# EAGLE design BottomPCB (EAGLE 6.3)
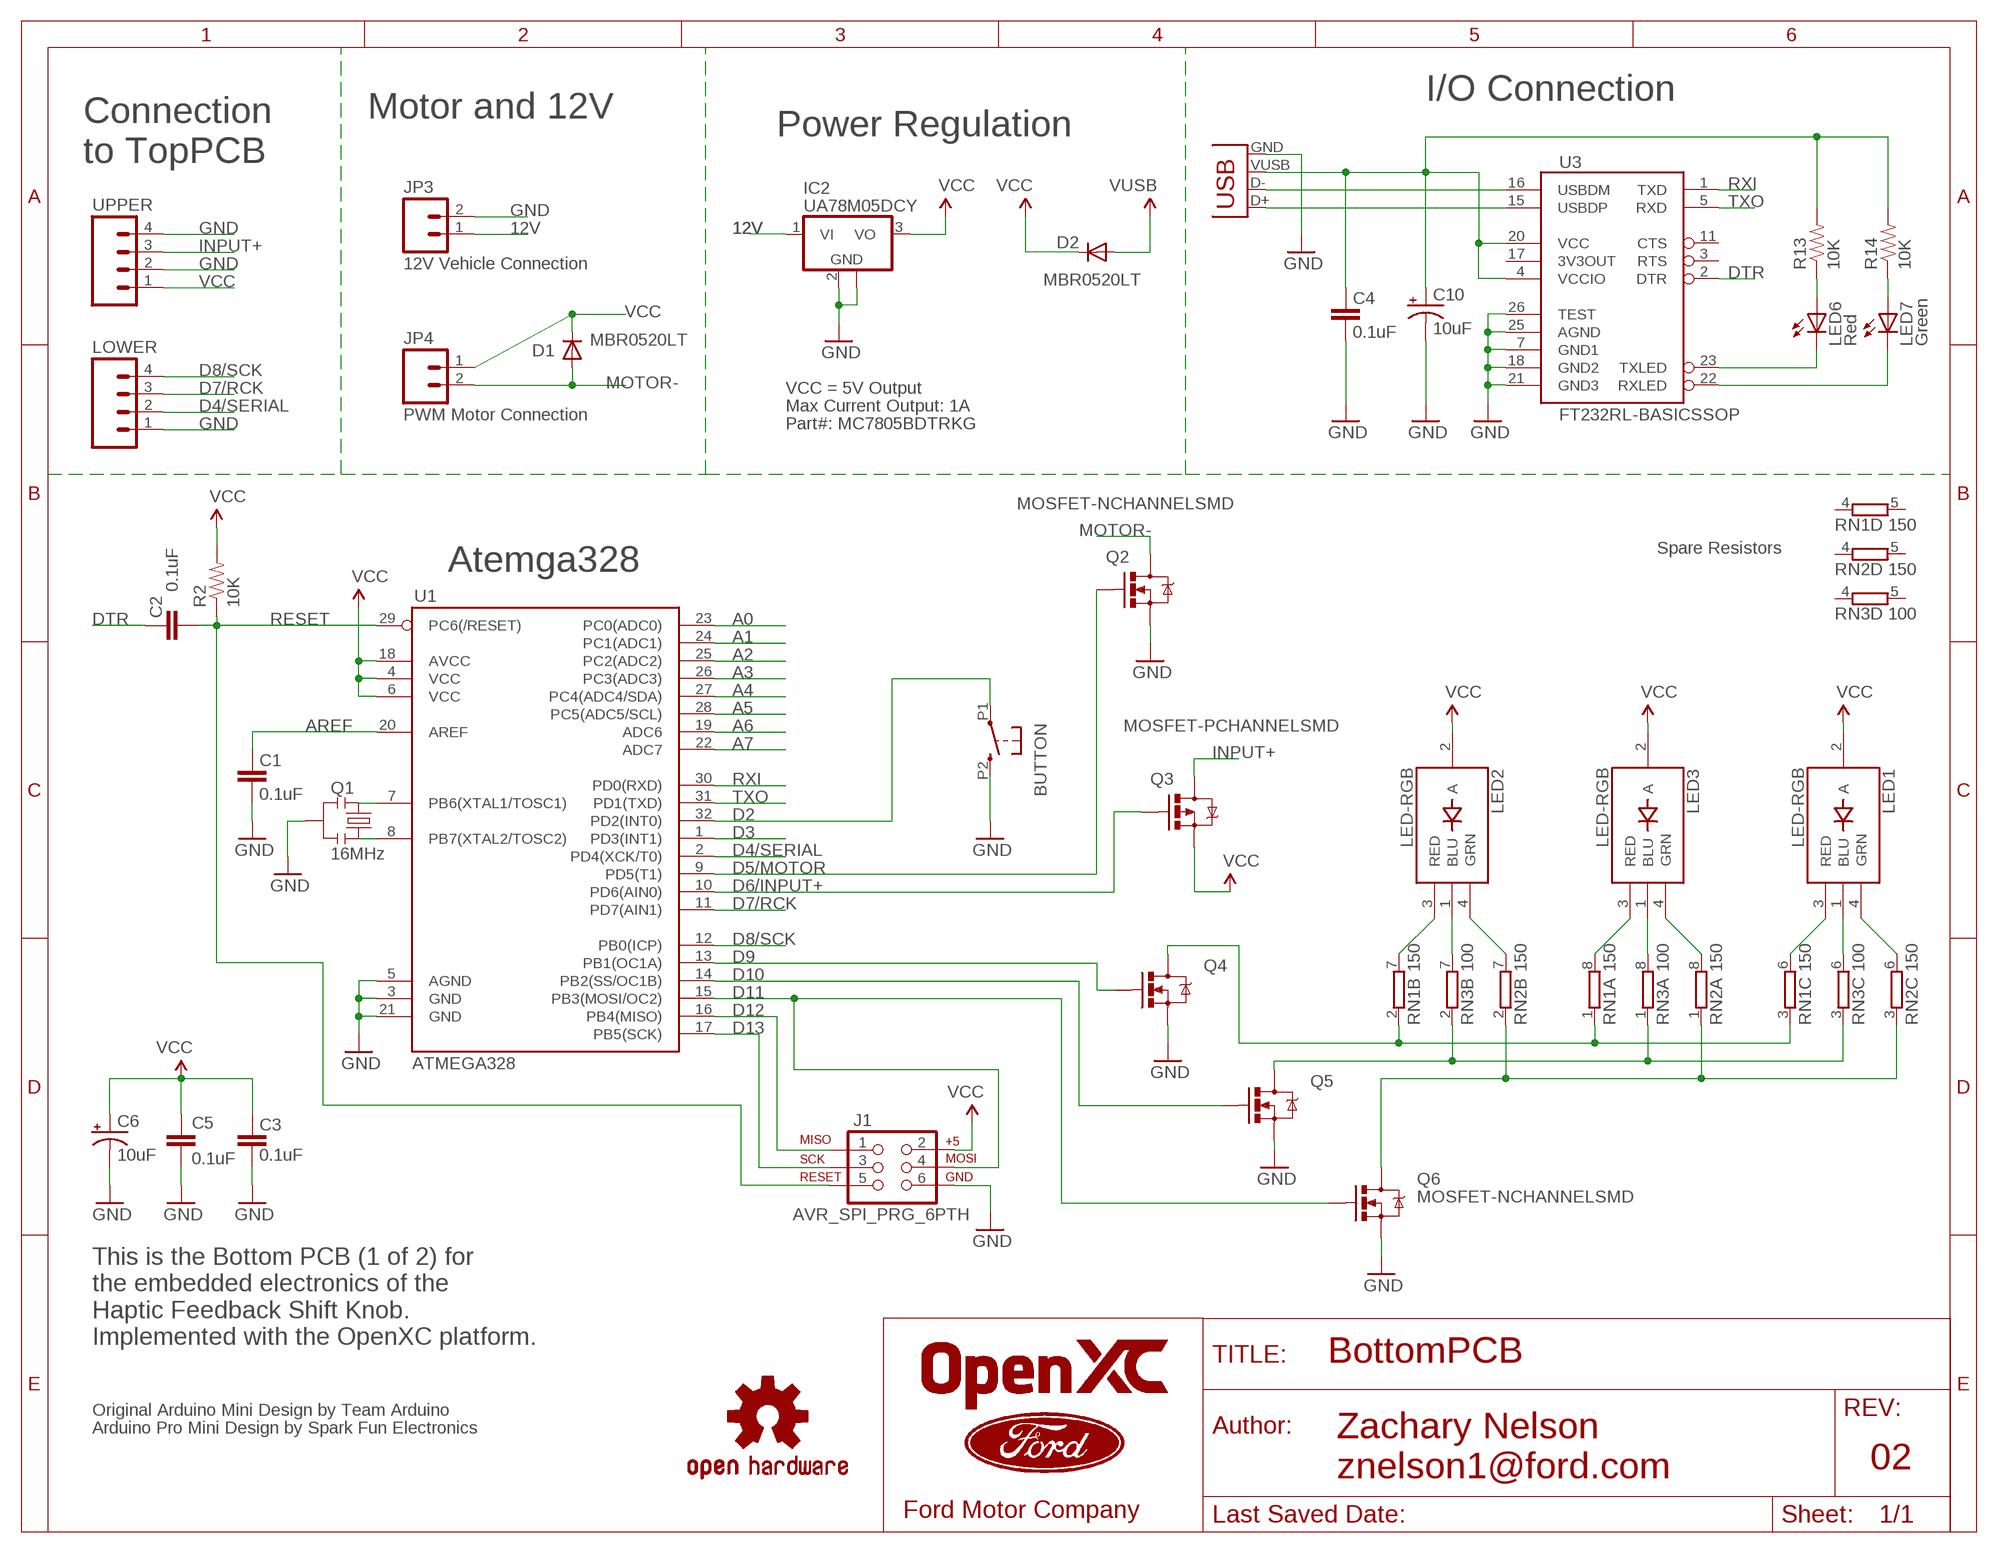
[diagram p0: schematic, sheet 1]

## Parts
BUTTON  BUTTON_EDGE  [BUTTON_EDGE]
C1  0.1uF  CAP0402-CAP  [0402-CAP]
C2  0.1uF  CAP0402-CAP  [0402-CAP]
C3  0.1uF  CAP0402-CAP  [0402-CAP]
C4  0.1uF  CAP0402-CAP  [0402-CAP]
C5  0.1uF  CAP0402-CAP  [0402-CAP]
C6  10uF  CAP_POL1206  [EIA3216]
C10  10uF  CAP_POL1206  [EIA3216]
D1  MBR0520LT  [SOD123]
D2  MBR0520LT  [SOD123]
IC2  UA78M05DCY  [SOT223]
J1  AVR_SPI_PRG_6PTH  [2X3]
JP3  12V Vehicle Connection  M02PTH  [1X02]
JP4  PWM Motor Connection  M02-JST-2MM-SMT  [JST-2-SMD]
LED1  LED-RGB  [LED-RGB_SMD-RIGHTANGLE]
LED2  LED-RGB  [LED-RGB_SMD-RIGHTANGLE]
LED3  LED-RGB  [LED-RGB_SMD-RIGHTANGLE]
LED6  Red  LED0603  [LED-0603]
LED7  Green  LED0603  [LED-0603]
LOWER  M04PTH  [1X04]
Q1  16MHz  RESONATORSMD  [RESONATOR-SMD]
Q2  MOSFET-NCHANNELSMD  [SOT23-3]
Q3  MOSFET-PCHANNELSMD  [SOT23-3]
Q4  MOSFET-NCHANNELSMD  [SOT23-3]
Q5  MOSFET-NCHANNELSMD  [SOT23-3]
Q6  MOSFET-NCHANNELSMD  [SOT23-3]
R2  10K  RESISTOR0402-RES  [0402-RES]
R13  10K  RESISTOR0402-RES  [0402-RES]
R14  10K  RESISTOR0402-RES  [0402-RES]
RN1  150  4R-NEXBS8V  [EXBS8V]
RN2  150  4R-NEXBS8V  [EXBS8V]
RN3  100  4R-NEXBS8V  [EXBS8V]
U1  ATMEGA328  ATMEGA168  [TQFP32-08]
U3  FT232RL-BASICSSOP  [SSOP28DB]
U6  USB-MINI-B_VERTICAL  [USB-MINI-B_VERTICAL]
U$3  OSHW-LOGOS  [OSHW-LOGO-S]
UPPER  M04PTH  [1X04]

## Nets
12V [vcc]: IC2.1(VI) JP3.1
A0: U1.23(PC0(ADC0))
A1: U1.24(PC1(ADC1))
A2: U1.25(PC2(ADC2))
A3: U1.26(PC3(ADC3))
A4: U1.27(PC4(ADC4/SDA))
A5: U1.28(PC5(ADC5/SCL))
A6: U1.19(ADC6)
A7: U1.22(ADC7)
AREF: C1.2 U1.20(AREF)
D2: BUTTON.P1 U1.32(PD2(INT0))
D3: U1.1(PD3(INT1))
D4/SERIAL: LOWER.2 U1.2(PD4(XCK/T0))
D5/MOTOR: Q2.1(G) U1.9(PD5(T1))
D6/INPUT+: Q3.1(G) U1.10(PD6(AIN0))
D7/RCK: LOWER.3 U1.11(PD7(AIN1))
D8/SCK: LOWER.4 U1.12(PB0(ICP))
D9: Q4.3(D) RN1.1 RN1.2 RN1.3
D10: Q5.3(D) RN3.1 RN3.2 RN3.3
D11: Q6.3(D) RN2.1 RN2.2 RN2.3
D12: J1.1 U1.16(PB4(MISO))
D13: J1.3 U1.17(PB5(SCK))
DTR: C2.2 U3.2(DTR)
GND: BUTTON.P2 C1.1 C3.1 C4.1 C5.2 C6.C(-) C10.C(-) IC2.2(GND) IC2.4(GND) J1.6 JP3.2 LOWER.1 Q1.2 Q2.2(S) Q4.2(S) Q5.2(S) Q6.2(S) U1.3(GND) U1.5(AGND) U1.21(GND) U3.7(GND1) U3.18(GND2) U3.21(GND3) U3.25(AGND) U3.26(TEST) U6.GND UPPER.2 UPPER.4
INPUT+: Q3.3(D) UPPER.3
MOTOR-: D1.A JP4.2 Q2.3(D)
N$1: Q1.1 U1.8(PB7(XTAL2/TOSC2))
N$2: Q1.3 U1.7(PB6(XTAL1/TOSC1))
N$4: LED2.3(RED) RN1.7
N$5: LED2.4(GRN) RN2.7
N$6: LED3.3(RED) RN1.8
N$7: LED1.1(BLU) RN3.6
N$8: LED3.4(GRN) RN2.8
N$9: LED1.3(RED) RN1.6
N$10: LED1.4(GRN) RN2.6
N$11: Q4.1(G) U1.13(PB1(OC1A))
N$12: Q5.1(G) U1.14(PB2(SS/OC1B))
N$15: J1.4 Q6.1(G) U1.15(PB3(MOSI/OC2))
N$16: LED2.1(BLU) RN3.7
N$20: LED3.1(BLU) RN3.8
N$21: U3.15(USBDP) U6.D+
N$22: U3.16(USBDM) U6.D-
N$23: LED6.A R13.1
N$24: LED7.A R14.1
RESET: C2.1 J1.5 R2.1 U1.29(PC6(/RESET))
RXI: U1.30(PD0(RXD)) U3.1(TXD)
RXLED1: LED7.C U3.22(RXLED)
TXLED1: LED6.C U3.23(TXLED)
TXO: U1.31(PD1(TXD)) U3.5(RXD)
VCC [vcc]: C3.2 C5.1 C6.A(+) D1.C D2.C IC2.3(VO) J1.2 JP4.1 LED1.2(A) LED2.2(A) LED3.2(A) Q3.2(S) R2.2 U1.4(VCC) U1.6(VCC) U1.18(AVCC) UPPER.1
VUSB: C4.2 C10.A(+) D2.A R13.2 R14.2 U3.4(VCCIO) U3.20(VCC) U6.VUSB(VBUS)
Unconnected: RN1.4 RN1.5 RN2.4 RN2.5 RN3.4 RN3.5 U3.3(RTS) U3.11(CTS) U3.17(3V3OUT)

## Notes on the sheet
- I/O Connection
- Motor and 12V
- Power Regulation
- Connection
  to TopPCB
- VCC = 5V Output
- Max Current Output: 1A
- Part#: MC7805BDTRKG
- Spare Resistors
- Atemga328
- This is the Bottom PCB (1 of 2) for 
  the embedded electronics of the 
  Haptic Feedback Shift Knob. 
  Implemented with the OpenXC platform.
- Original Arduino Mini Design by Team Arduino
- Arduino Pro Mini Design by Spark Fun Electronics
- 02
- Zachary Nelson
  znelson1@ford.com

## Library data of the parts
BUTTON = FORD_frames:BUTTON_EDGE
C1-C5 = SparkFun:CAP: Capacitor Standard 0603 ceramic capacitor, and 0.1" leaded capacitor.
C6 C10 = SparkFun:CAP_POL: Capacitor Polarized These are standard SMD and PTH capacitors. Normally 10uF, 47uF, and 100uF in electrolytic and tantalum varieties. Always verify the external diameter of the through hole cap, it varies with capacity, voltage, and manufacturer. The EIA devices should be standard.
D1 D2 = diode:MBR0520LT: SCHOTTKY BARRIER RECTIFIER Source: http://onsemi.com .. MBR0520LT1-D.pdf
IC2 = linear:UA78M*: POSITIVE-VOLTAGE REGULATORS Source: http://focus.ti.com/lit/ds/symlink/ua78m33.pdf
J1 = SparkFun-Connectors:AVR_SPI_PRG_6: AVR ISP 6 Pin This is the reduced ISP connector for AVR programming. Common on Arduino. This footprint will take up less PCB space and can be used with a 10-pin to 6-pin adapter such as SKU: BOB-08508
JP3 = SparkFun-Connectors:M02: Header 2 Standard 2-pin 0.1" header. Use with straight break away headers (SKU : PRT-00116), right angle break away headers (PRT-00553), swiss pins (PRT-00743), machine pins (PRT-00117), and female headers (PRT-00115). Molex polarized connector foot print use with SKU : PRT-08233 with associated crimp pins and housings.
JP4 = SparkFun-Connectors:M02: Header 2 Standard 2-pin 0.1" header. Use with straight break away headers (SKU : PRT-00116), right angle break away headers (PRT-00553), swiss pins (PRT-00743), machine pins (PRT-00117), and female headers (PRT-00115). Molex polarized connector foot print use with SKU : PRT-08233 with associated crimp pins and housings.; PROD_ID: CONN-08352
LED1-LED3 = FORD_frames:LED-RGB: This is an RGB LED from digikey part number: 516-2232-1-ND SMD - Right Angle RGB LED
LED6 LED7 = SparkFun:LED: LEDs Standard schematic elements and footprints for 5mm, 3mm, 1206, and 0603 sized LEDs. 5mm - Spark Fun Electronics SKU : COM-00529 (and others)
LOWER UPPER = SparkFun-Connectors:M04: Header 4 Standard 4-pin 0.1" header. Use with straight break away headers (SKU : PRT-00116), right angle break away headers (PRT-00553), swiss pins (PRT-00743), machine pins (PRT-00117), and female headers (PRT-00115). Molex polarized connector foot print use with SKU : PRT-08231 with associated crimp pins and housings. 1MM SMD Version SKU: PRT-10208
Q1 = SparkFun:RESONATOR: Resonator Small SMD resonator. This is the itty bitty 10/20MHz resonators with built in caps. CSTCE10M0G55 and CSTCE20M0V53. Footprint has been reviewed closely but hasn't been tested yet.
Q2 Q4-Q6 = SparkFun-DiscreteSemi:MOSFET-NCHANNEL: Generic NMOS footprint
Q3 = SparkFun-DiscreteSemi:MOSFET-PCHANNEL: Generic PMOSFET
R2 R13 R14 = SparkFun:RESISTOR: Resistor Basic schematic elements and footprints for 0603, 1206, and PTH resistors.
RN1-RN3 = resistor-dil:4R-N: Array Chip Resistor Source: RS Component / Phycomp; OC_FARNELL: unknown; OC_NEWARK: unknown
U1 = SparkFun:ATMEGA168
U3 = SparkFun-DigitalIC:FT232RL-BASIC: USB UART This is the simplified version of the FT232RL unit. Only what you need, nothing you don't. Spark Fun Electronics SKU : COM-00650
U6 = FORD_frames:USB-MINI-B_VERTICAL: Vertical mount mini USB.
U$3 = SparkFun:OSHW-LOGO: Open Source Hardware Logo This logo indicates the piece of hardware it is found on incorporates a OSHW license and/or adheres to the definition of open source hardware found here: http://freedomdefined.org/OSHW

## Net classes
1 vcc: width 0.254 mm

## Board
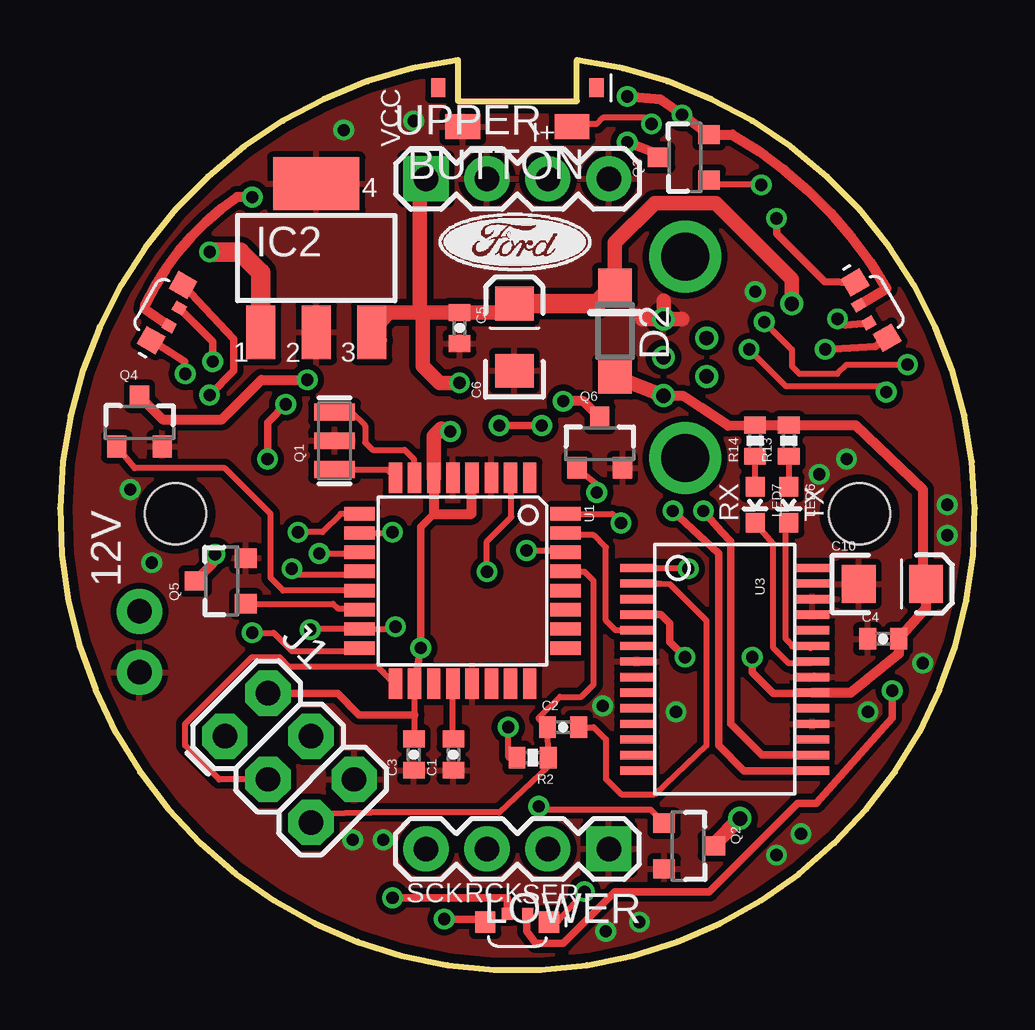
[diagram p1: board, top side]
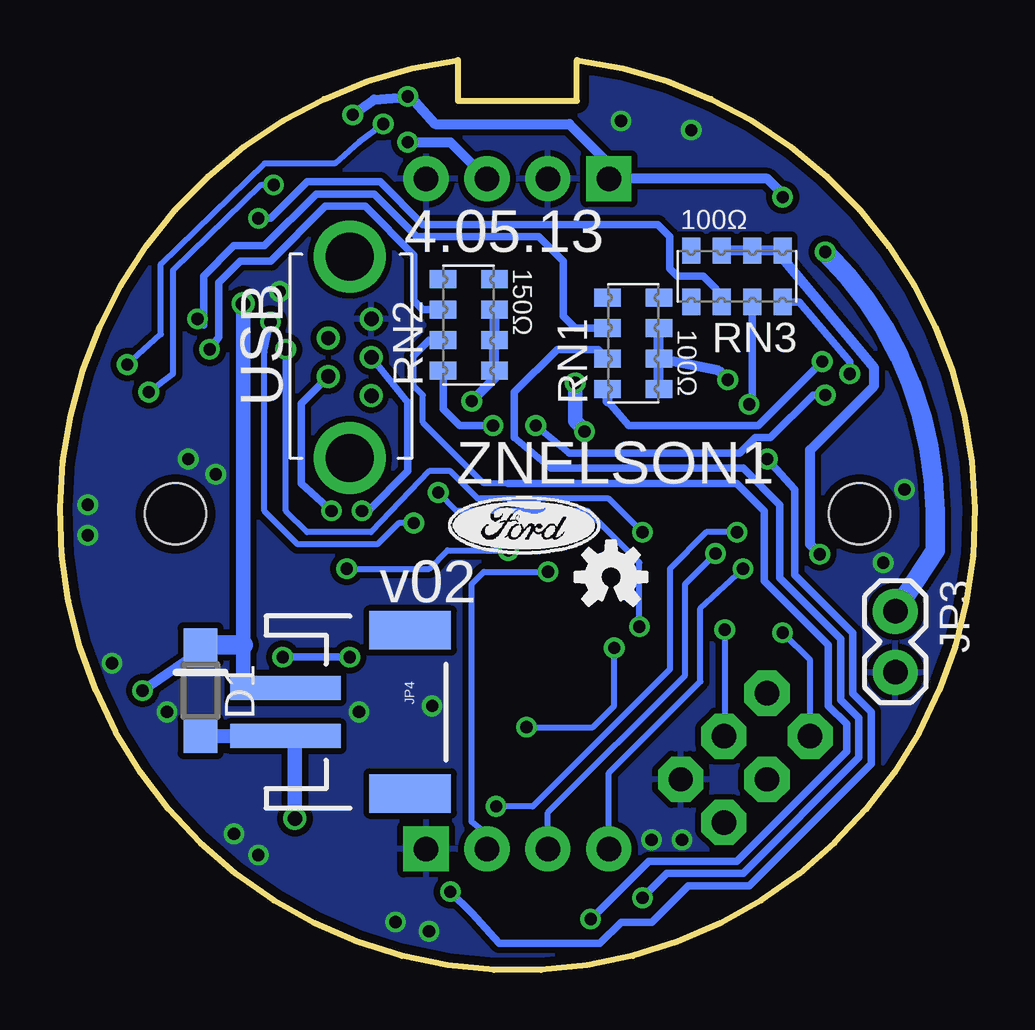
[diagram p2: board, bottom side, seen from below]

Size 38.12 x 37.94 mm. Coordinates in mm from the lower left corner, seen from the top.
Outline: 16.6,36.22 21.54,36.22
Outline: 16.58,36.22 16.58,37.94 arc345 21.54,37.94 21.54,36.22
Copper layers (1*16): Top 0.0356mm / dielectric 1.5011mm / Bottom 0.0356mm
Design rules "LaenPCBOrder": minimum track width 6mil, minimum drill 13mil, track to track 6mil, track to pad 6mil, pad to pad 6mil, via to via 6mil, smd to smd 6mil, copper to edge 15mil, drill to drill 6mil, minimum pad ring 7mil, minimum via ring 7mil, stop-mask expansion 4mil, vias tented up to drill 0mil, thermal gap 10mil
Holes 2.54 mm at 4.81,19.01 33.31,19.01

### Footprints (pad centres in the part's own frame; a part is rotated, then mirrored left to right if it is on the bottom)
BUTTON_EDGE = smd 0.6 x 0.8: NC1 -3.3,0.95; NC2 3.3,0.95 | smd 1.45 x 1.05: P1 -2.275,2.57; P2 2.275,2.57
0402-CAP = smd 0.7 x 0.9: 1 -0.65,0; 2 0.65,0
EIA3216 = smd 1.4 x 1.6: A 1.4,0; C -1.4,0
SOD123 = smd 1.4 x 1.4: A 1.9,0; C -1.9,0
SOT223 = smd 1.219 x 2.235: 1 -2.311,-3.099; 2 0,-3.099; 3 2.311,-3.099 | smd 3.6 x 2.2: 4 0,3.099
2X3 = drill 1.016 pad 1.88 octagon: 1 0,0; 2 0,2.54; 3 2.54,0; 4 2.54,2.54; 5 5.08,0; 6 5.08,2.54
1X02 = drill 1.016 pad 1.88: 1 0,0; 2 2.54,0
JST-2-SMD = smd 1 x 4.6: 1 -1,-3.7; 2 1,-3.7 | smd 1.6 x 3.4: NC1 -3.4,1.5; NC2 3.4,1.5
LED-RGB_SMD-RIGHTANGLE = smd 0.85 x 0.9: 1 -1.32,0; 4 1.34,0 | smd 0.45 x 0.5: 2 -0.43,-0.35; 3 0.43,-0.35
LED-0603 = smd 0.8 x 0.8: A 0,-0.75; C 0,0.75
1X04 = drill 1.016 pad 1.88 square: 1 0,0 | drill 1.016 pad 1.88: 2 2.54,0; 3 5.08,0; 4 7.62,0
RESONATOR-SMD = smd 0.7 x 1.7: 1 -1.2,0; 2 0,0; 3 1.2,0
SOT23-3 = smd 0.8 x 0.9: 1 -0.95,-1; 2 0.95,-1; 3 0,1.1
0402-RES = smd 0.7 x 0.9: 1 -0.65,0; 2 0.65,0
EXBS8V = smd 0.75 x 1.1: 1 -1.905,-1.07; 2 -0.635,-1.07; 3 0.635,-1.07; 4 1.905,-1.07; 5 1.905,1.07; 6 0.635,1.07; 7 -0.635,1.07; 8 -1.905,1.07
TQFP32-08 = smd 1.27 x 0.559: 1 -4.293,2.8; 2 -4.293,2; 3 -4.293,1.2; 4 -4.293,0.4; 5 -4.293,-0.4; 6 -4.293,-1.2; 7 -4.293,-2; 8 -4.293,-2.8; 17 4.293,-2.8; 18 4.293,-2; 19 4.293,-1.2; 20 4.293,-0.4; 21 4.293,0.4; 22 4.293,1.2; 23 4.293,2; 24 4.293,2.8 | smd 0.559 x 1.27: 9 -2.8,-4.293; 10 -2,-4.293; 11 -1.2,-4.293; 12 -0.4,-4.293; 13 0.4,-4.293; 14 1.2,-4.293; 15 2,-4.293; 16 2.8,-4.293; 25 2.8,4.293; 26 2,4.293; 27 1.2,4.293; 28 0.4,4.293; 29 -0.4,4.293; 30 -1.2,4.293; 31 -2,4.293; 32 -2.8,4.293
SSOP28DB = smd 0.348 x 1.397: 1 -4.225,-3.656; 2 -3.575,-3.656; 3 -2.925,-3.656; 4 -2.275,-3.656; 5 -1.625,-3.656; 6 -0.975,-3.656; 7 -0.325,-3.656; 8 0.325,-3.656; 9 0.975,-3.656; 10 1.625,-3.656; 11 2.275,-3.656; 12 2.925,-3.656; 13 3.575,-3.656; 14 4.225,-3.656; 15 4.225,3.656; 16 3.575,3.656; 17 2.925,3.656; 18 2.275,3.656; 19 1.625,3.656; 20 0.975,3.656; 21 0.325,3.656; 22 -0.325,3.656; 23 -0.975,3.656; 24 -1.625,3.656; 25 -2.275,3.656; 26 -2.925,3.656; 27 -3.575,3.656; 28 -4.225,3.656
USB-MINI-B_VERTICAL = drill 0.6: D+ 0.9,0; D- -0.9,-0.8; GND 0.9,1.6; NC -0.9,0.8; VUSB 0.9,-1.6 | drill 2: P$6 0,-4.2; P$7 0,4.2

### Placement (x,y rotation side)
BUTTON  19.06,37.73 180 top
C1  16.39,8.98 90 top
C2  20.97,10.12 0 top
C3  14.74,8.98 90 top
C4  34.3,13.81 0 top
C5  16.65,26.76 270 top
C6  18.93,26.38 90 top
C10  34.68,16.09 0 top
D1  32.27,11.65 270 bottom
D2  23.12,26.63 270 top
IC2  10.68,29.68 0 top
J1  6.87,9.74 315 top
JP3  3.31,14.95 270 bottom
JP4  25.03,10.76 270 bottom
LED1  33.79,27.52 300 top
LED2  19.06,2 180 top
LED3  4.46,27.4 60 top
LED6  30.36,19.39 180 top
LED7  28.97,19.39 180 top
LOWER  22.87,5.04 180 top
Q1  11.44,22.06 90 top
Q2  26.17,5.17 270 top
Q3  26.05,33.87 90 top
Q4  3.31,22.82 0 top
Q5  6.74,16.22 90 top
Q6  22.49,21.93 0 top
R2  19.7,8.85 180 top
R13  30.36,22.06 90 top
R14  28.97,22.06 90 top
RN1  14.23,26.13 90 bottom
RN2  21.09,26.89 90 bottom
RN3  9.92,28.92 180 bottom
U1  16.77,16.22 270 top
U3  27.7,12.54 270 top
U6  26.05,25.54 0 bottom
U$1  [DOCFIELD]  -49.52,-52.11 0 top  (outside the outline)
U$3  15.16,16.39 0 bottom
UPPER  15.25,32.98 0 top

### Tracks (layer width: path | path; a pad name or v marks a point on that pad's centre or on a via)
12V  (via drill 0.51)
  Top 0.813: v6.23,29.94 7.5,29.94 8.37,29.07 IC2.1
  Bottom 0.813: JP3.1 1.66,17.49 1.66,19.14 arc-45 v6.23,29.94
AREF
  Top 0.254: C1.2 16.37,9.65 U1.20
D2  (via drill 0.51)
  Top 0.254: U1.32 23,19.02 v23.38,18.63 | BUTTON.P1 21.85,35.27 22.36,35.27 22.62,35.52 24.39,35.52 v24.65,35.27 | v29.35,27.01 30.49,25.87 30.49,25.17 30.81,24.86 32.4,24.86 32.78,25.24 v35.32,25.24
  Bottom 0.254: v23.38,18.63 24.01,18.63 24.9,17.74 28.2,17.74 29.6,19.14 29.6,25.74 v29.35,27.01 | v24.65,35.27 25.66,34.51 26.68,33.62 29.6,33.62 33.92,29.43 33.92,26.51 v35.32,25.24
D4/SERIAL  (via drill 0.51)
  Top 0.254: 18.81,20.54 U1.2 18.81,20.48 18.81,18.89 17.79,17.87 v17.79,16.6
  Bottom 0.254: LOWER.2 20.33,5.68 20.97,6.19 20.97,16.09 20.46,16.6 v17.79,16.6
D5/MOTOR  (via drill 0.51)
  Top 0.254: U1.9 11.69,19.02 10.93,18.25 v9.92,18.25 | v19.95,6.82 20.33,6.69 24.6,6.69 Q2.1
  Bottom 0.254: v9.92,18.25 11.19,18.25 12.71,16.73 12.71,12.54 18.43,6.82 v19.95,6.82
D6/INPUT+  (via drill 0.51)
  Top 0.254: U1.10 13.82,18.22 v13.85,18.25 | v29.22,32.73 27.37,32.73 Q3.1 | v28.71,25.87 30.24,24.35 34.17,24.35 v34.43,24.09
  Bottom 0.254: v13.85,18.25 15.25,19.65 20.71,19.65 21.85,20.79 22.74,20.79 25.16,18.25 27.82,18.25 28.71,19.14 v28.71,25.87 | v29.22,32.73 29.73,32.73 33.41,29.17 33.41,24.86 v34.43,24.09
D7/RCK  (via drill 0.51)
  Top 0.254: v10.81,17.36 12.42,17.36 U1.11
  Bottom 0.254: LOWER.3 17.79,6.57 12.08,12.28 12.08,16.09 v10.81,17.36
D8/SCK  (via drill 0.51)
  Top 0.254: U1.12 12.34,16.47 9.92,16.47 v9.66,16.73
  Bottom 0.254: LOWER.4 15.25,8.22 11.44,12.03 11.44,15.08 v9.66,16.73
D9  (via drill 0.51)
  Top 0.406: Q4.3 4.29,22.95 6.74,22.95 8.39,24.6 v10.3,24.6
  Bottom 0.406: RN1.1 RN1.2 | RN1.2 RN1.3 | v10.3,24.6 10.68,24.98 RN1.2
D10  (via drill 0.51)
  Top 0.406: Q5.3 6.36,16.94 v6.46,17.34
  Bottom 0.406: RN3.3 RN3.2 RN3.1 8.01,29.68 4.2,25.11 4.2,24.35 6.87,21.68 6.87,17.74 v6.46,17.34
D11  (via drill 0.51)
  Top 0.406: Q6.3 21.81,23.71 v20.97,23.71
  Bottom 0.406: RN2.3 RN2.2 RN2.1 20.02,24.66 v20.97,23.71
D12  (via drill 0.51)
  Top 0.254: v8.01,14.06 8.9,14.06 9.66,13.3 12.36,13.3 arc90 U1.16
  Bottom 0.254: J1.1 6.87,12.92 v8.01,14.06
D13
  Top 0.254: J1.3 6.63,7.95 5.22,9.36 5.22,10.25 8.01,13.04 9.15,13.04 9.54,12.66 13.22,12.66 13.47,12.41 13.95,11.9 U1.17
DTR
  Top 0.254: C2.2 22.24,10.12 22.74,9.62 22.74,7.96 23.38,7.33 24.78,7.33 26.93,9.36 26.93,14.57 25.41,16.09 25.05,16.11 U3.2
GND  (via drill 0.51)
  Top 0.61: U6.GND 24.27,27.14 | U6.GND 25.16,27.9 | U6.GND 25.92,27.14
  other vias: 22.62,11.01 25.66,10.76 35.95,12.79 36.97,18.12 36.97,19.39 30.87,5.68 29.86,4.79 24.14,2 22.74,1.61 3.82,16.98 2.93,20.03 11.82,35.02 14.74,35.4 28.97,28.28 12.2,5.42 13.47,5.42 32.78,21.3 31.63,20.66 33.67,10.76
  pour Top (isolate 0.254): 0.01,19.01 arc-90 19.06,38.06 19.31,38.06 arc-90 38.11,19.27 38.11,19.01 arc-90 19.06,-0.04 arc-90
  pour Bottom (isolate 0.254): 0.01,19.01 arc-90 19.06,38.06 19.31,38.06 arc-90 38.11,19.27 38.11,19.01 arc-90 19.06,-0.04 arc-90
INPUT+  (via drill 0.51)
  Top 0.305: Q3.3 24.9,34
  Top 0.406: 24.9,34 v23.63,34.51
  Bottom 0.406: v23.63,34.51 21.85,34.51 UPPER.3
MOTOR-  (via drill 0.6)
  Top 0.61: v28.33,6.31 27.27,5.25 Q2.3
  Bottom 0.61: v28.33,6.31 28.33,9.36 JP4.2 D1.A
N$1
  Top 0.254: Q1.1 13.63,20.86 U1.8
N$2
  Top 0.254: Q1.3 12.15,23.26 12.71,22.7 12.71,22 13.03,21.68 14.36,21.68 14.74,21.3 14.74,20.54 U1.7
N$4  (via drill 0.51)
  Top 0.305: v13.85,3.01 18.63,3.01 LED2.3
  Bottom 0.305: v13.85,3.01 12.84,4.03 9.66,4.03 4.84,8.85 4.84,10.5 5.6,11.27 5.6,13.81 8.14,16.35 8.14,19.39 9.66,20.92 17.66,20.92 19.19,22.19 19.19,24.09 17.41,25.87 15.69,25.87 RN1.7
N$5  (via drill 0.51)
  Top 0.305: v16.01,2.12 17.34,2.12 LED2.4
  Bottom 0.254: 19.44,20.28 20.46,20.28 23,22.82 23,23.97 23.38,24.35 23.38,25.62
  Bottom 0.305: 19.44,20.28 9.92,20.28 8.77,19.14 8.77,16.22 6.11,13.55 6.11,11.01 5.34,10.25 5.34,9.11 9.92,4.54 13.6,4.54 v16.01,2.12 | 23.38,25.62 22.74,26.25 RN2.7
N$6  (via drill 0.51)
  Top 0.305: LED3.3 6.36,26.21 v6.36,25.36
  Bottom 0.305: 15.3,23.71 14.42,22.7 9.03,22.7 v6.36,25.36
  Bottom 0.406: 15.3,23.71 RN1.8
N$7  (via drill 0.51)
  Top 0.305: LED1.1 31.86,28.69 29.86,30.7 v29.86,31.33
  Bottom 0.305: RN3.6 10.81,28.41 11.31,28.92 12.39,28.92 12.71,29.24 12.71,30.57 13.22,31.08 23,31.08 24.78,32.86 27.82,32.86 29.35,31.33 v29.86,31.33
N$8  (via drill 0.51)
  Top 0.305: v6.23,23.97 7.25,24.98 7.25,26.3 LED3.4 | v20.08,22.7 v18.3,22.7
  Bottom 0.305: v18.3,22.7 16.9,21.55 9.79,21.55 9.15,22.19 8.52,22.19 6.74,23.97 v6.23,23.97 | 22.11,24.98 RN2.8 22.16,23.39 21.47,22.7 v20.08,22.7
N$9  (via drill 0.51)
  Top 0.305: v32.4,27.14 32.73,26.89 LED1.3
  Bottom 0.305: v32.4,27.14 32.14,26.89 32.14,28.92 30.87,30.19 29.6,30.19 27.44,32.35 25.03,32.35 23.25,30.57 18.17,30.57 17.16,29.55 17.16,27.27 16.65,26.76 RN1.6
N$10  (via drill 0.51)
  Top 0.305: v31.89,25.87 33.97,26 LED1.4
  Bottom 0.305: v31.89,25.87 31.51,26.38 31.51,28.67 30.62,29.55 29.35,29.55 27.06,31.84 25.41,31.84 23.38,29.81 23.38,27.9 23,27.52 RN2.6
N$11
  Top 0.254: U1.13 9.3,15.82 8.77,16.35 8.77,19.01 6.87,20.92 3.11,20.92 Q4.1
N$12
  Top 0.254: Q5.1 11.37,15.27 11.57,15.08 12.42,15.08 U1.14
N$15  (via drill 0.51)
  Top 0.254: v10.42,14.19 10.46,14.22 U1.15 13.89,14.22 v13.98,14.31 | v22.36,19.9 22.36,20.24 Q6.1
  Bottom 0.254: v10.42,14.19 10.42,9.78 J1.4 | v13.98,14.31 13.98,16.98 16.14,19.14 21.6,19.14 v22.36,19.9
N$16  (via drill 0.51)
  Top 0.254: v21.85,3.27 20.76,2.05 LED2.1
  Top 0.305: v8.65,21.3 8.65,22.82 v9.41,23.59 | 20.2,2 LED2.1
  Bottom 0.305: v8.65,21.3 7.5,20.03 7.5,16.47 5.09,14.06 5.09,11.52 4.33,10.76 4.33,8.6 9.41,3.52 11.95,3.52 13.47,2 14.74,2 15.63,1.11 19.82,1.11 20.97,2.38 v21.85,3.27 | v9.41,23.59 9.28,23.84 RN3.7
N$20  (via drill 0.51)
  Top 0.305: v5.22,24.86 5.19,25.36 LED3.1
  Bottom 0.305: v5.22,24.86 5.22,25.36 7.32,27.85 RN3.8
N$21  (via drill 0.51)
  Top 0.305: U3.15 28.49,8.31 27.44,9.36 27.44,17.36 v25.54,19.14
  Bottom 0.305: U6.D+ 23.63,23.65 23.63,20.79 25.28,19.14 v25.54,19.14
N$22  (via drill 0.51)
  Top 0.305: U3.16 29.24,8.96 27.95,10.25 27.95,17.87 27.57,18.25 v26.81,19.14
  Bottom 0.305: U6.D- 28.08,23.61 28.08,20.28 v26.81,19.14
N$23
  Top 0.254: R13.1 LED6.A
N$24
  Top 0.254: LED7.A R14.1
RESET
  Top 0.254: J1.5 10.77,6.53 12.96,6.57 18.3,6.57 20.33,8.47 20.33,8.84 R2.1 C2.1 19.93,10.49 20.84,11.39 21.73,11.39 22.24,11.9 22.24,16.22 21.85,16.6 21.09,16.6 U1.29
RXI  (via drill 0.51)
  Top 0.254: U3.1 26.08,16.76 v26.17,16.73 | v19.44,17.49 20.84,17.49 21.01,17.36 U1.30
  Bottom 0.254: v26.17,16.73 22.74,16.73 21.98,17.49 v19.44,17.49
RXLED1
  Top 0.254: U3.22 31.28,12.79 30.36,12.79 29.73,13.43 29.73,17.76 LED7.C
TXLED1
  Top 0.254: 31.27,13.43 U3.23 | 30.53,13.51 30.24,13.81 30.24,18.38 LED6.C
  Top 0.305: 30.53,13.51 U3.23
TXO
  Top 0.254: U3.5 23.15,14.16 22.74,14.57 22.74,17.62 22.24,18.12 21.16,18.12 U1.31
VCC  (via drill 0.51, 0.6)
  Top 0.254: C3.2 14.77,9.66 14.77,10.63 U1.18 | R2.2 18.68,8.85 v18.68,10.12
  Top 0.305: U1.18 v15.03,13.43 15.03,18.47 15.57,19.01 | J1.2 8.68,11.52 11.57,11.52 12.46,10.63 14.77,10.63 | LED2.2 19.44,2.39 19.44,1.61 19.82,1.11 20.97,1.11 23.12,3.27 27.06,3.27 30.74,6.95 31.51,6.95 34.68,10.5 v34.68,11.65
  Top 0.406: U1.6 15.57,19.01 17.16,19.01 17.16,20.51 U1.4 | LED1.2 34.43,28.41 arc30 28.02,34.82 Q3.2 26.87,34.95 v25.92,35.65 25.03,36.29 v23.63,36.41 | v8.01,32.22 7.38,32.22 arc30 3.57,27.78 3.53,27.56 LED3.2
  Top 0.61: 13.32,26.25 IC2.3 13.69,27.41 15,27.41 | UPPER.1 15,32.48 15,27.41 | C6.A arc-90 18.56,27.41 C5.1 15.12,27.41 | v30.49,27.78 30.49,28.79 27.32,31.97 24.78,31.97 23.12,30.32 D2.C | 15.12,27.41 15,27.41 | U1.6 15.57,22.25 15.89,22.57 v16.27,22.44 | v16.65,24.47 15.82,24.47 15.12,25.17 15.12,27.41
  Top 0.813: D2.C 22.37,27.78 C6.A
  Bottom 0.254: v18.68,10.12 15.92,10.12 15.03,11.01 v15.03,13.43
  Bottom 0.406: v25.92,35.65 25.03,36.29 23.51,36.41 22.49,35.27 16.9,35.27 15.25,33.62 UPPER.1 8.65,32.98 8.01,32.35 v8.01,32.22 | 30.49,11.76 30.49,13.55 | v34.68,11.65 32.27,13.3 D1.C
  Bottom 0.61: JP4.1 30.49,11.76 v30.49,27.78 | v16.27,22.44 16.33,22.57 16.65,22.89 v16.65,24.47
  Bottom 0.813: 30.49,13.55 D1.C
VUSB  (via drill 0.51)
  Top 0.305: U3.4 25.04,14.81 25.41,14.44 25.41,13.68 v26.05,13.04 | U3.20 31.31,11.52 29.73,11.52 28.84,12.41 v28.84,13.04
  Top 0.406: U6.VUSB 25.94,23.94 26.68,23.46 27.84,22.7 R14.2 R13.2 33.14,22.71 35.95,20.03 35.95,16.35 C10.A 36.08,15.06 C4.2 34.95,13.19 32.94,11.56 U3.20
  Top 0.61: U6.VUSB D2.A
  Bottom 0.305: v28.84,13.04 v26.05,13.04

### Text on the board
tPlace: I+ | VCC | RX | TX | 12V | SER | SCK | RCK
bPlace: 100Ω | 4.05.13 | 150Ω | 100Ω | ZNELSON1 | v02
Document: 02 | Zachary Nelson / znelson1@ford.com